# Altium project APD.PrjPcb
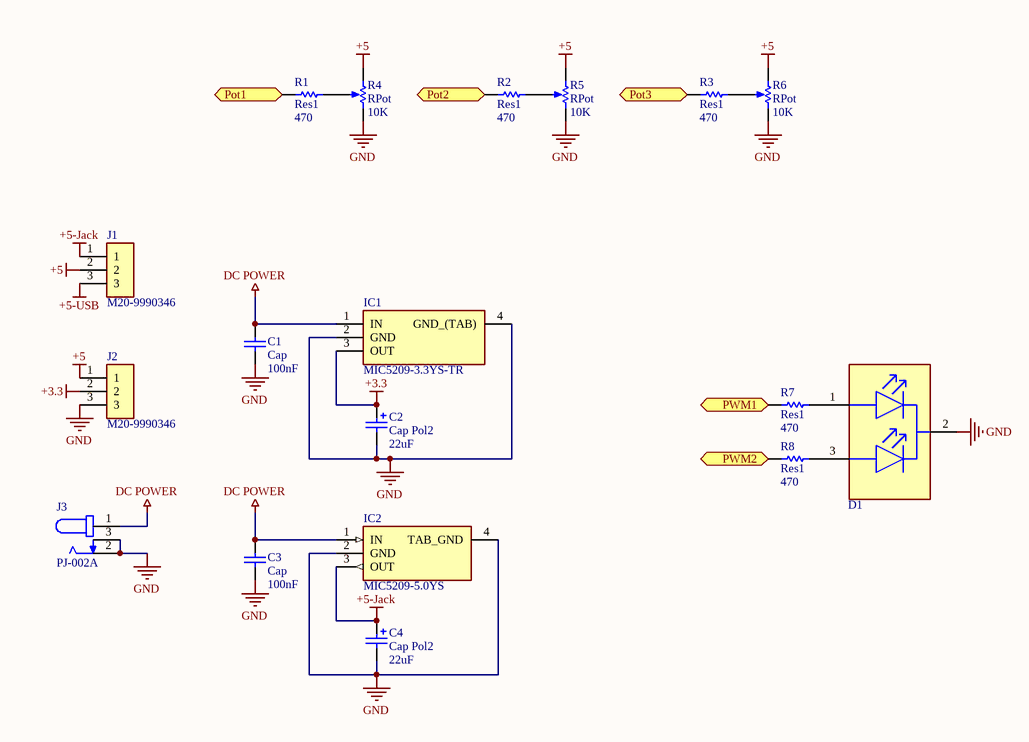
[diagram p0: Power.SchDoc]
5 sheets, 67 parts. Net scope: flat (ports and power ports of the same name join across sheets).
Board file: PCB1.PcbDoc
Sheets:
  Power.SchDoc
  PIC.SchDoc
  LCD-MEM-TEMP.SchDoc
  UART.SchDoc
  Switch.SchDoc

## Sheet Power.SchDoc
size A4

### Parts
C1  Cap  value 100nF  [Cap 100nF]
C2  Cap Pol2  value 22uF  [CAP+ 22UF]
C3  Cap  value 100nF  [Cap 100nF]
C4  Cap Pol2  value 22uF  [CAP+ 22UF]
D1  LTL1BEKVJNN  [Bicolor LED]  (value not drawn)
IC1  MIC5209-3.3YS-TR  [LDO]
IC2  MIC5209-5.0YS  [LDO]
J1  M20-9990346  [header 3 pins male]
J2  M20-9990346  [Header 3 pins fem.]
J3  PJ-002A  [DC Jack]
R1  Res1  value 470  [Resistor 1210]
R2  Res1  value 470  [Resistor 1210]
R3  Res1  value 470  [Resistor 1210]
R4  RPot  value 10K  [POT]
R5  RPot  value 10K  [POT]
R6  RPot  value 10K  [POT]
R7  Res1  value 470  [Resistor 1210]
R8  Res1  value 470  [Resistor 1210]

### Ports
Pot1 (bidir), Pot2 (bidir), Pot3 (bidir), PWM1 (bidir), PWM2 (bidir)

### Nets
+3.3: C2.1 IC1.3(OUT) J2.2
+5: J1.2 J2.1 R4.1(TOP) R5.1(TOP) R6.1(TOP)
+5-Jack: C4.1 IC2.3(OUT) J1.1
+5-USB: J1.3
DC POWER: C1.1 C3.1 IC1.1(IN) IC2.1(IN) J3.1
GND: C1.2 C2.2 C3.2 C4.2 D1.2(COMMON_CATHODE) IC1.2(GND) IC1.4(GND_(TAB)) IC2.2(GND) IC2.4(TAB_GND) J2.3 J3.2 J3.3 R4.2(BOT) R5.2(BOT) R6.2(BOT)
NetD1_1: D1.1(RED_A) R7.2
NetD1_3: D1.3(GREEN_A) R8.2
NetIC3_2: R1.1 ; port Pot1
NetIC3_3: R2.1 ; port Pot2
NetIC3_4: R3.1 ; port Pot3
NetIC3_12: R8.1 ; port PWM2
NetIC3_13: R7.1 ; port PWM1
NetR1_2: R1.2 R4.3(TAP)
NetR2_2: R2.2 R5.3(TAP)
NetR3_2: R3.2 R6.3(TAP)

### Library data of the parts
C1 C3 = Cap: Capacitor; Published: 8-Jun-2000; LatestRevisionDate: 17-Jul-2002; LatestRevisionNote: Re-released for DXP Platform.; PackageReference: RAD-0.3; Publisher: Altium Limited; PackageDescription: Radial Cap, Thru-Hole; 2 Leads; 0.3 in Pin Spacing
C2 C4 = Cap Pol2: Polarized Capacitor (Axial); Published: 8-Jun-2000; LatestRevisionDate: 17-Jul-2002; LatestRevisionNote: Re-released for DXP Platform.; PackageReference: POLAR0.8; Publisher: Altium Limited; PackageDescription: Polarized Capacitor; 2 Leads
IC1 = MIC5209-3.3YS-TR: Integrated Circuit; Manufacturer_Name: Microchip; Datasheet Link: http://ww1.microchip.com/downloads/en/DeviceDoc/mic5209.pdf; Height: 1.7mm; Manufacturer_Part_Number: MIC5209-3.3YS-TR; Arrow Part Number: MIC5209-3.3YS-TR; Arrow Price/Stock: https://www.arrow.com/en/products/mic5209-3.3ys-tr/microchip-technology; Mouser Part Number: 998-MIC5209-3.3YSTR; Mouser Price/Stock: https://www.mouser.co.uk/ProductDetail/Microchip-Technology-Micrel/MIC5209-33YS-TR?qs=U6T8BxXiZAXms9mvoyYO%2FQ%3D%3D
IC2 = MIC5209-5.0YS: Integrated Circuit; Manufacturer_Name: Microchip; Datasheet Link: http://www.micrel.com/_PDF/mic5209.pdf; Height: 1.8mm; Manufacturer_Part_Number: MIC5209-5.0YS; Arrow Part Number: MIC5209-5.0YS; Arrow Price/Stock: https://www.arrow.com/en/products/mic5209-5.0ys/microchip-technology; Mouser Part Number: 998-MIC5209-5.0YS; Mouser Price/Stock: https://www.mouser.com/Search/Refine.aspx?Keyword=998-MIC5209-5.0YS
J1 J2 = M20-9990346: Connector; Manufacturer_Name: Harwin; Datasheet Link: http://uk.rs-online.com/web/p/products/7457068; Height: 8.64mm; Manufacturer_Part_Number: M20-9990346; Mouser Part Number: 855-M20-9990346; Mouser Price/Stock: https://www.mouser.co.uk/ProductDetail/Harwin/M20-9990346?qs=ulE8k0yEMYbyhQ3uXpFs8Q%3D%3D
J3 = PJ-002A: DC jack; MF: CUI Devices; Package: None; Price: None; CUI_purchase_URL: https://www.cuidevices.com/product/interconnect/connectors/dc-power-connectors/jacks/pj-002a?utm_source=snapeda.com&utm_medium=referral&utm_campaign=snapedaBOM; SnapEDA_Link: https://www.snapeda.com/parts/PJ-002A/CUI%20Devices/view-part/287588/?ref=snap; Availability: Unavailable; Value: *; MP: PJ-002A
R1-R3 R7 R8 = Res1: Resistor; Published: 8-Jun-2000; LatestRevisionDate: 17-Jul-2002; LatestRevisionNote: Re-released for DXP Platform.; PackageReference: AXIAL-0.3; Publisher: Altium Limited; PackageDescription: Axial Device, Thru-Hole; 2 Leads; 0.3 in Pin Spacing
R4-R6 = RPot: Potentiometer; Sim Note: Enter the Resistance value and the set point into parameter fields.; Set Position: 0.5; Published: 8-Jun-2000; LatestRevisionDate: 17-Jul-2002; LatestRevisionNote: Re-released for DXP Platform.; PackageReference: VR5; Publisher: Altium Limited; PackageDescription: Variable Resistor, Thru-Hole; 3 Leads

## Sheet PIC.SchDoc
size A4
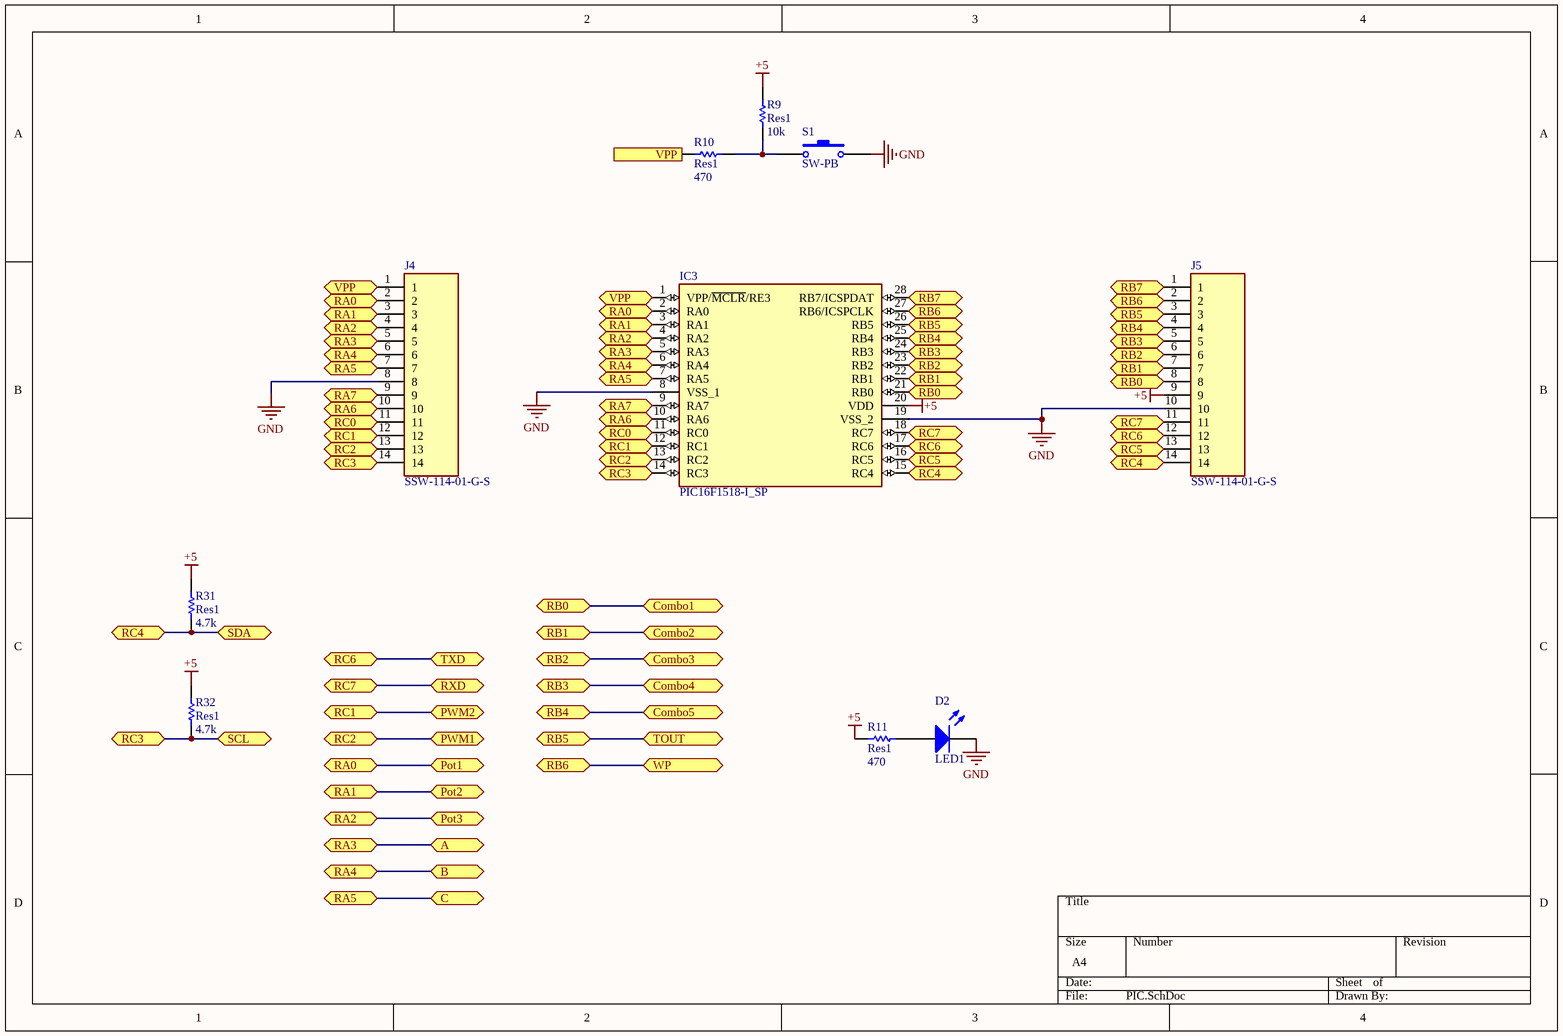
[diagram p1: PIC.SchDoc]

### Parts
D2  LED1  [LED 3mm]
IC3  PIC16F1518-I_SP  [DIP28]
J4  SSW-114-01-G-S  [Header 14 pins fem.]
J5  SSW-114-01-G-S  [Header 14 pins fem.]
R9  Res1  value 10k  [Resistor 1210]
R10  Res1  value 470  [Resistor 1210]
R11  Res1  value 470  [Resistor 1210]
R31  Res1  value 4.7k  [Resistor 1206]
R32  Res1  value 4.7k  [Resistor 1206]
S1  SW-PB  [Button]

### Ports
A (bidir), B (bidir), C (bidir), Combo1 (bidir), Combo2 (bidir), Combo3 (bidir), Combo4 (bidir), Combo5 (bidir), Pot1 (bidir), Pot2 (bidir), Pot3 (bidir), PWM1 (bidir), PWM2 (bidir), RA0 (bidir), RA1 (bidir), RA2 (bidir), RA3 (bidir), RA4 (bidir), RA5 (bidir), RA6 (bidir), RA7 (bidir), RB0 (bidir), RB1 (bidir), RB2 (bidir), RB3 (bidir), RB4 (bidir), RB5 (bidir), RB6 (bidir), RB7 (bidir), RC0 (bidir), RC1 (bidir), RC2 (bidir), RC3 (bidir), RC4 (bidir), RC5 (bidir), RC6 (bidir), RC7 (bidir), RXD (bidir), SCL (bidir), SDA (bidir), TOUT (bidir), TXD (bidir), VPP (bidir), VPP (out), WP (bidir)

### Nets
+5: IC3.20(VDD) J5.9 R9.2 R11.1 R31.2 R32.2
GND: D2.2(K) IC3.8(VSS_1) IC3.19(VSS_2) J4.8 J5.10 S1.2
NetD2_1: D2.1(A) R11.2
NetIC3_1: IC3.1(VPP/~{MCLR}/RE3) J4.1 R10.1 ; port VPP
NetIC3_2: IC3.2(RA0) J4.2 ; port RA0, port Pot1
NetIC3_3: IC3.3(RA1) J4.3 ; port RA1, port Pot2
NetIC3_4: IC3.4(RA2) J4.4 ; port RA2, port Pot3
NetIC3_5: IC3.5(RA3) J4.5 ; port RA3, port A
NetIC3_6: IC3.6(RA4) J4.6 ; port RA4, port B
NetIC3_7: IC3.7(RA5) J4.7 ; port RA5, port C
NetIC3_9: IC3.9(RA7) J4.9 ; port RA7
NetIC3_10: IC3.10(RA6) J4.10 ; port RA6
NetIC3_11: IC3.11(RC0) J4.11 ; port RC0
NetIC3_12: IC3.12(RC1) J4.12 ; port RC1, port PWM2
NetIC3_13: IC3.13(RC2) J4.13 ; port RC2, port PWM1
NetIC3_14: IC3.14(RC3) J4.14 R32.1 ; port RC3, port SCL
NetIC3_15: IC3.15(RC4) J5.14 R31.1 ; port RC4, port SDA
NetIC3_16: IC3.16(RC5) J5.13 ; port RC5
NetIC3_17: IC3.17(RC6) J5.12 ; port RC6, port TXD
NetIC3_18: IC3.18(RC7) J5.11 ; port RC7, port RXD
NetIC3_21: IC3.21(RB0) J5.8 ; port RB0, port Combo1
NetIC3_22: IC3.22(RB1) J5.7 ; port RB1, port Combo2
NetIC3_23: IC3.23(RB2) J5.6 ; port RB2, port Combo3
NetIC3_24: IC3.24(RB3) J5.5 ; port RB3, port Combo4
NetIC3_25: IC3.25(RB4) J5.4 ; port RB4, port Combo5
NetIC3_26: IC3.26(RB5) J5.3 ; port RB5, port TOUT
NetIC3_27: IC3.27(RB6/ICSPCLK) J5.2 ; port RB6, port WP
NetIC3_28: IC3.28(RB7/ICSPDAT) J5.1 ; port RB7
NetR9_1: R9.1 R10.2 S1.1

### Library data of the parts
D2 = LED1: Typical RED GaAs LED; Published: 8-Jun-2000; LatestRevisionDate: 08-Jul-2005; LatestRevisionNote: Mech Layer 1 removed.; PackageReference: LED-1; Publisher: Altium Limited; PackageDescription: LED; 2 Leads
IC3 = PIC16F1518-I_SP: Integrated Circuit; Manufacturer_Name: Microchip; Manufacturer_Part_Number: PIC16F1518-I/SP; Datasheet Link: http://ww1.microchip.com/downloads/en/DeviceDoc/40001452F.pdf; Height: 5.08mm; Arrow Part Number: PIC16F1518-I/SP; Arrow Price/Stock: https://www.arrow.com/en/products/pic16f1518-isp/microchip-technology; Mouser Part Number: 579-PIC16F1518-I/SP; Mouser Price/Stock: https://www.mouser.com/Search/Refine.aspx?Keyword=579-PIC16F1518-I%2FSP
J4 J5 = SSW-114-01-G-S: Connector; Manufacturer_Name: SAMTEC; Datasheet Link: https://eu.mouser.com/datasheet/2/527/ssw_th-1507658.pdf; Height: 8.51mm; Manufacturer_Part_Number: SSW-114-01-G-S; Arrow Part Number: SSW-114-01-G-S; Arrow Price/Stock: https://www.arrow.com/en/products/ssw-114-01-g-s/samtec; Mouser Part Number: 200-SSW11401GS; Mouser Price/Stock: https://www.mouser.co.uk/ProductDetail/Samtec/SSW-114-01-G-S?qs=FESYatJ8odJdl4aGY%2FwgtQ%3D%3D
R9-R11 R31 R32 = Res1: Resistor; Published: 8-Jun-2000; LatestRevisionDate: 17-Jul-2002; LatestRevisionNote: Re-released for DXP Platform.; PackageReference: AXIAL-0.3; Publisher: Altium Limited; PackageDescription: Axial Device, Thru-Hole; 2 Leads; 0.3 in Pin Spacing
S1 = SW-PB: Switch; Published: 24-Mar-1999; LatestRevisionDate: 17-Jul-2002; LatestRevisionNote: Re-released for DXP Platform.; PackageReference: SPST-2; Publisher: Altium Limited; PackageDescription: Switch; 2 Leads

## Sheet LCD-MEM-TEMP.SchDoc
size A4
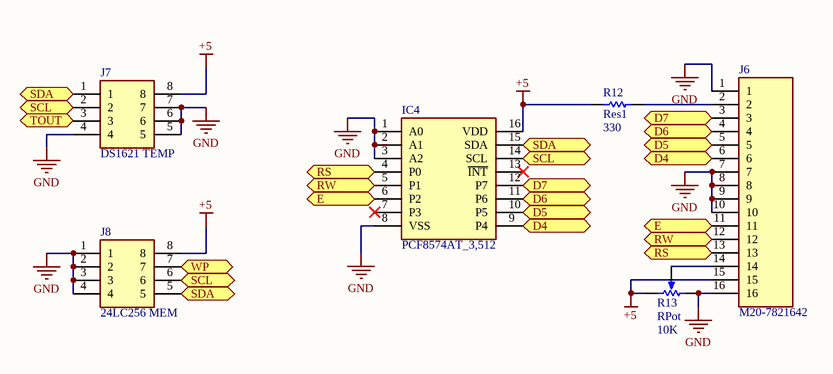
[diagram p2: LCD-MEM-TEMP.SchDoc]

### Parts
IC4  PCF8574AT_3,512  [I2C LCD IC]
J6  M20-7821642  [Header 16 pins fem.]
J7  DS1621 TEMP  [DIL 8 pins]
J8  24LC256 MEM  [DIL 8 pins]
R12  Res1  value 330  [Resistor 1210]
R13  RPot  value 10K  [POT]

### Ports
D4 (bidir), D5 (bidir), D6 (bidir), D7 (bidir), E (bidir), RS (bidir), RW (bidir), SCL (bidir), SDA (bidir), TOUT (bidir), WP (bidir)

### Nets
+5: IC4.16(VDD) J6.15 J7.8 J8.8 R12.1 R13.2(BOT)
GND: IC4.1(A0) IC4.2(A1) IC4.3(A2) IC4.8(VSS) J6.1 J6.7 J6.8 J6.9 J6.10 J6.16 J7.4 J7.5 J7.6 J7.7 J8.1 J8.2 J8.3 J8.4 R13.1(TOP)
NetIC3_14: IC4.14(SCL) J7.2 J8.6 ; port SCL
NetIC3_15: IC4.15(SDA) J7.1 J8.5 ; port SDA
NetIC3_27: J8.7 ; port WP
NetIC4_4: IC4.4(P0) J6.13 ; port RS
NetIC4_5: IC4.5(P1) J6.12 ; port RW
NetIC4_6: IC4.6(P2) J6.11 ; port E
NetIC4_9: IC4.9(P4) J6.6 ; port D4
NetIC4_10: IC4.10(P5) J6.5 ; port D5
NetIC4_11: IC4.11(P6) J6.4 ; port D6
NetIC4_12: IC4.12(P7) J6.3 ; port D7
NetJ6_2: J6.2 R12.2
NetJ6_14: J6.14 R13.3(TAP)

Not connected (* = marked no-connect by the designer): IC4 7(P3)* 13(~{INT})*; J7 3

### Library data of the parts
IC4 = PCF8574AT_3,512: Integrated Circuit; Manufacturer_Name: Nexperia; Manufacturer_Part_Number: PCF8574AT/3,512; Datasheet Link: https://www.nxp.com/docs/en/data-sheet/PCF8574_PCF8574A.pdf; Height: 2.65mm; Arrow Part Number: PCF8574AT/3,512; Arrow Price/Stock: https://www.arrow.com/en/products/pcf8574at3512/nxp-semiconductors; Mouser Part Number: 771-PCF85AT3512; Mouser Price/Stock: https://www.mouser.com/Search/Refine.aspx?Keyword=771-PCF85AT3512
J6 = M20-7821642: Connector; Manufacturer_Name: Harwin; Datasheet Link: https://componentsearchengine.com//M20-7821642.pdf; Height: 8.65mm; Mouser2 Part Number: 855-M20-7821642; Mouser2 Price/Stock: https://www.mouser.com/Search/Refine.aspx?Keyword=855-M20-7821642; Manufacturer_Part_Number: M20-7821642
J7 J8 = 110-41-308-41-001000: Connector; Manufacturer_Name: Mill-Max; Datasheet Link: https://www.arrow.com/en/products/110-41-308-41-001000/mill-max; Height: 4.19mm; Manufacturer_Part_Number: 110-41-308-41-001000
R12 = Res1: Resistor; Published: 8-Jun-2000; LatestRevisionDate: 17-Jul-2002; LatestRevisionNote: Re-released for DXP Platform.; PackageReference: AXIAL-0.3; Publisher: Altium Limited; PackageDescription: Axial Device, Thru-Hole; 2 Leads; 0.3 in Pin Spacing
R13 = RPot: as R4 on sheet Power; Published: 8-Jun-2000; LatestRevisionDate: 17-Jul-2002; LatestRevisionNote: Re-released for DXP Platform.; PackageReference: VR5; Publisher: Altium Limited; PackageDescription: Variable Resistor, Thru-Hole; 3 Leads

## Sheet UART.SchDoc
size A4
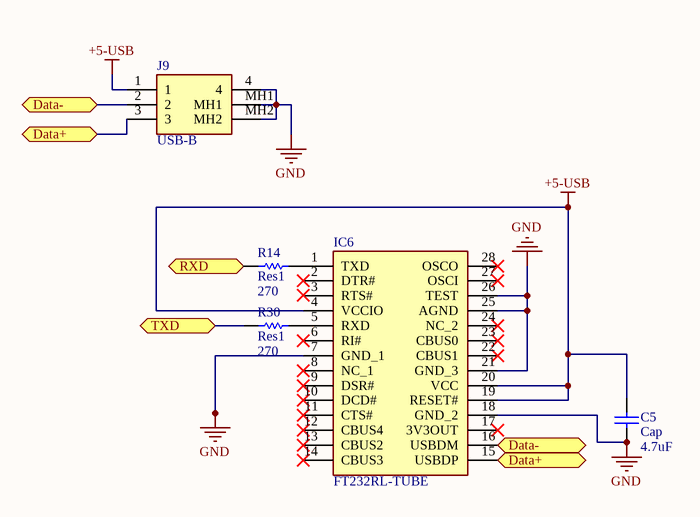
[diagram p3: UART.SchDoc]

### Parts
C5  Cap  value 4.7uF  [cap 4.7uf]
IC6  FT232RL-TUBE  [SOP65P780X200-28N]
J9  USB-B  [USB B]
R14  Res1  value 270  [Resistor 1206]
R30  Res1  value 270  [Resistor 1206]

### Ports
Data+ (bidir), Data- (bidir), RXD (bidir), TXD (bidir)

### Nets
+5-USB: C5.2 IC6.4(VCCIO) IC6.19(RESET#) IC6.20(VCC) J9.1
GND: C5.1 IC6.7(GND_1) IC6.18(GND_2) IC6.21(GND_3) IC6.25(AGND) IC6.26(TEST) J9.4 J9.MH1 J9.MH2
NetIC3_17: R30.1 ; port TXD
NetIC3_18: R14.1 ; port RXD
NetIC6_1: IC6.1(TXD) R14.2
NetIC6_5: IC6.5(RXD) R30.2
NetIC6_15: IC6.15(USBDP) J9.3 ; port Data+
NetIC6_16: IC6.16(USBDM) J9.2 ; port Data-

Not connected (* = marked no-connect by the designer): IC6 2(DTR#)* 3(RTS#)* 6(RI#)* 8(NC_1)* 9(DSR#)* 10(DCD#)* 11(CTS#)* 12(CBUS4)* 13(CBUS2)* 14(CBUS3)* 17(3V3OUT)* 22(CBUS1)* 23(CBUS0)* 24(NC_2)* 27(OSCI)* 28(OSCO)*

### Library data of the parts
C5 = Cap: Capacitor; Published: 8-Jun-2000; LatestRevisionDate: 17-Jul-2002; LatestRevisionNote: Re-released for DXP Platform.; PackageReference: RAD-0.3; Publisher: Altium Limited; PackageDescription: Radial Cap, Thru-Hole; 2 Leads; 0.3 in Pin Spacing
IC6 = FT232RL-TUBE: Integrated Circuit; Manufacturer_Name: FTDI Chip; Datasheet Link: http://www.ftdichip.com/Support/Documents/DataSheets/ICs/DS_FT232R.pdf; Height: 2mm; Manufacturer_Part_Number: FT232RL-TUBE; Arrow Part Number: FT232RL-TUBE; Arrow Price/Stock: https://www.arrow.com/en/products/ft232rl-tube/ftdi-chip; Mouser Part Number: 895-FT232RL-TUBE; Mouser Price/Stock: https://www.mouser.co.uk/ProductDetail/FTDI/FT232RL-TUBE?qs=D1%2FPMqvA100UF95YMvGN8w%3D%3D
J9 = USBR-B-S-S-O-TH: Connector; Manufacturer_Name: SAMTEC; Datasheet Link: https://componentsearchengine.com/Datasheets/2/USBR-B-S-S-O-TH.pdf; Height: 11mm; Manufacturer_Part_Number: USBR-B-S-S-O-TH; Arrow Part Number: USBR-B-S-S-O-TH; Arrow Price/Stock: https://www.arrow.com/en/products/usbr-b-s-s-o-th/samtec; Mouser Part Number: 200-USBRBSSOTH; Mouser Price/Stock: https://www.mouser.co.uk/ProductDetail/Samtec/USBR-B-S-S-O-TH?qs=Sk19l0%2FxcWm4mdmoDSlrBQ%3D%3D
R14 R30 = Res1: Resistor; Published: 8-Jun-2000; LatestRevisionDate: 17-Jul-2002; LatestRevisionNote: Re-released for DXP Platform.; PackageReference: AXIAL-0.3; Publisher: Altium Limited; PackageDescription: Axial Device, Thru-Hole; 2 Leads; 0.3 in Pin Spacing

## Sheet Switch.SchDoc
size A4
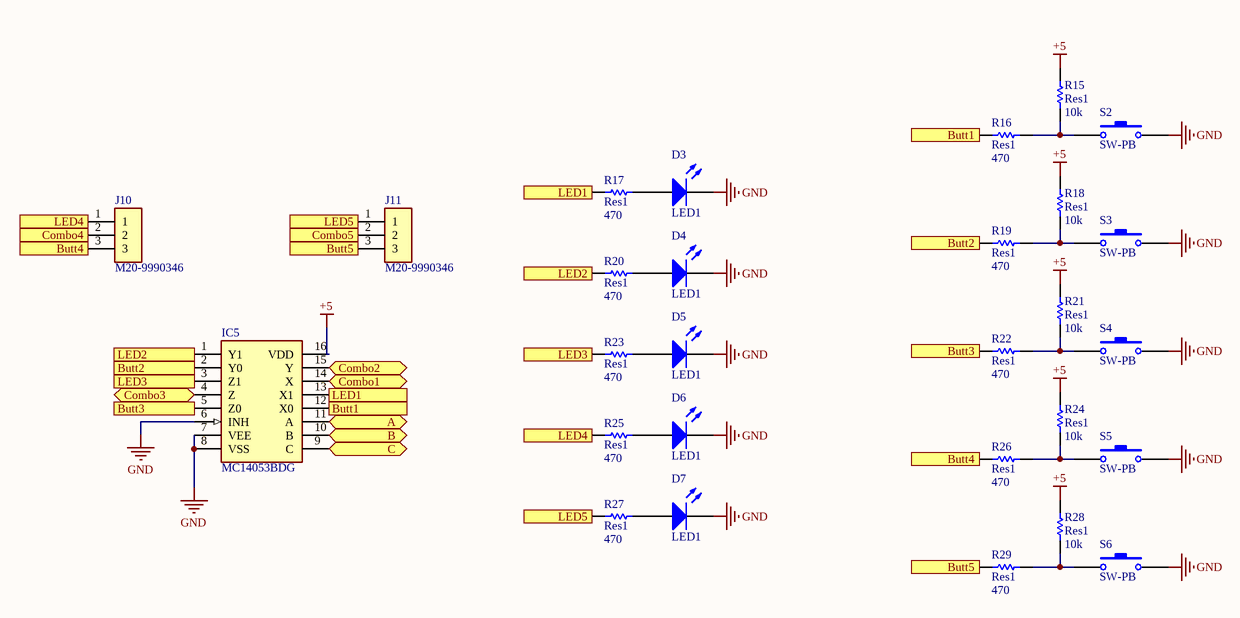
[diagram p4: Switch.SchDoc]

### Parts
D3  LED1  [LED 3mm]
D4  LED1  [LED 3mm]
D5  LED1  [LED 3mm]
D6  LED1  [LED 3mm]
D7  LED1  [LED 3mm]
IC5  MC14053BDG  [Triple SPDT switch]
J10  M20-9990346  [header 3 pins male]
J11  M20-9990346  [header 3 pins male]
R15  Res1  value 10k  [Resistor 1210]
R16  Res1  value 470  [Resistor 1210]
R17  Res1  value 470  [Resistor 1210]
R18  Res1  value 10k  [Resistor 1210]
R19  Res1  value 470  [Resistor 1210]
R20  Res1  value 470  [Resistor 1210]
R21  Res1  value 10k  [Resistor 1210]
R22  Res1  value 470  [Resistor 1210]
R23  Res1  value 470  [Resistor 1210]
R24  Res1  value 10k  [Resistor 1210]
R25  Res1  value 470  [Resistor 1210]
R26  Res1  value 470  [Resistor 1210]
R27  Res1  value 470  [Resistor 1210]
R28  Res1  value 10k  [Resistor 1210]
R29  Res1  value 470  [Resistor 1210]
S2  SW-PB  [Button]
S3  SW-PB  [Button]
S4  SW-PB  [Button]
S5  SW-PB  [Button]
S6  SW-PB  [Button]

### Ports
A (bidir), B (bidir), Butt1 (in), Butt1 (out), Butt2 (in), Butt2 (out), Butt3 (in), Butt3 (out), Butt4 (in), Butt4 (out), Butt5 (in), Butt5 (out), C (bidir), Combo1 (bidir), Combo2 (bidir), Combo3 (bidir), Combo4, Combo5, LED1 (in), LED1 (out), LED2 (in), LED2 (out), LED3 (in), LED3 (out), LED4 (in), LED4 (out), LED5 (in), LED5 (out)

### Nets
+5: IC5.16(VDD) R15.2 R18.2 R21.2 R24.2 R28.2
GND: D3.2(K) D4.2(K) D5.2(K) D6.2(K) D7.2(K) IC5.6(INH) IC5.7(VEE) IC5.8(VSS) S2.2 S3.2 S4.2 S5.2 S6.2
NetD3_1: D3.1(A) R17.1
NetD4_1: D4.1(A) R20.1
NetD5_1: D5.1(A) R23.1
NetD6_1: D6.1(A) R25.1
NetD7_1: D7.1(A) R27.1
NetIC3_5: IC5.11(A) ; port A
NetIC3_6: IC5.10(B) ; port B
NetIC3_7: IC5.9(C) ; port C
NetIC3_21: IC5.14(X) ; port Combo1
NetIC3_22: IC5.15(Y) ; port Combo2
NetIC3_23: IC5.4(Z) ; port Combo3
NetIC3_24: J10.2 ; port Combo4
NetIC3_25: J11.2 ; port Combo5
NetIC5_1: IC5.1(Y1) R20.2 ; port LED2
NetIC5_2: IC5.2(Y0) R19.1 ; port Butt2
NetIC5_3: IC5.3(Z1) R23.2 ; port LED3
NetIC5_5: IC5.5(Z0) R22.1 ; port Butt3
NetIC5_12: IC5.12(X0) R16.1 ; port Butt1
NetIC5_13: IC5.13(X1) R17.2 ; port LED1
NetJ10_1: J10.1 R25.2 ; port LED4
NetJ10_3: J10.3 R26.1 ; port Butt4
NetJ11_1: J11.1 R27.2 ; port LED5
NetJ11_3: J11.3 R29.1 ; port Butt5
NetR15_1: R15.1 R16.2 S2.1
NetR18_1: R18.1 R19.2 S3.1
NetR21_1: R21.1 R22.2 S4.1
NetR24_1: R24.1 R26.2 S5.1
NetR28_1: R28.1 R29.2 S6.1

### Library data of the parts
D3-D7 = LED1: Typical RED GaAs LED; Published: 8-Jun-2000; LatestRevisionDate: 08-Jul-2005; LatestRevisionNote: Mech Layer 1 removed.; PackageReference: LED-1; Publisher: Altium Limited; PackageDescription: LED; 2 Leads
IC5 = MC14053BDG: Integrated Circuit; Manufacturer_Name: ON Semiconductor; Datasheet Link: http://www.onsemi.com/pub/Collateral/MC14051B-D.PDF; Height: 1.75mm; Manufacturer_Part_Number: MC14053BDG; Arrow Part Number: MC14053BDG; Arrow Price/Stock: https://www.arrow.com/en/products/mc14053bdg/on-semiconductor; Mouser Part Number: 863-MC14053BDG; Mouser Price/Stock: https://www.mouser.co.uk/ProductDetail/ON-Semiconductor/MC14053BDG?qs=g2rIOKKlpobK7Wa1TqI4Yg%3D%3D
J10 J11 = M20-9990346: Connector; Manufacturer_Name: Harwin; Datasheet Link: http://uk.rs-online.com/web/p/products/7457068; Height: 8.64mm; Manufacturer_Part_Number: M20-9990346; Mouser Part Number: 855-M20-9990346; Mouser Price/Stock: https://www.mouser.co.uk/ProductDetail/Harwin/M20-9990346?qs=ulE8k0yEMYbyhQ3uXpFs8Q%3D%3D
R15-R29 = Res1: Resistor; Published: 8-Jun-2000; LatestRevisionDate: 17-Jul-2002; LatestRevisionNote: Re-released for DXP Platform.; PackageReference: AXIAL-0.3; Publisher: Altium Limited; PackageDescription: Axial Device, Thru-Hole; 2 Leads; 0.3 in Pin Spacing
S2-S6 = SW-PB: Switch; Published: 24-Mar-1999; LatestRevisionDate: 17-Jul-2002; LatestRevisionNote: Re-released for DXP Platform.; PackageReference: SPST-2; Publisher: Altium Limited; PackageDescription: Switch; 2 Leads

## Nets that join several sheets
+5: Power (5 pins), PIC (6 pins), LCD-MEM-TEMP (6 pins), Switch (6 pins)
+5-USB: Power (J1.3), UART (5 pins)
GND: Power (15 pins), PIC (6 pins), LCD-MEM-TEMP (19 pins), UART (9 pins), Switch (13 pins)
NetIC3_2: Power (R1.1), PIC (IC3.2 J4.2)
NetIC3_3: Power (R2.1), PIC (IC3.3 J4.3)
NetIC3_4: Power (R3.1), PIC (IC3.4 J4.4)
NetIC3_5: PIC (IC3.5 J4.5), Switch (IC5.11)
NetIC3_6: PIC (IC3.6 J4.6), Switch (IC5.10)
NetIC3_7: PIC (IC3.7 J4.7), Switch (IC5.9)
NetIC3_12: Power (R8.1), PIC (IC3.12 J4.12)
NetIC3_13: Power (R7.1), PIC (IC3.13 J4.13)
NetIC3_14: PIC (IC3.14 J4.14 R32.1), LCD-MEM-TEMP (IC4.14 J7.2 J8.6)
NetIC3_15: PIC (IC3.15 J5.14 R31.1), LCD-MEM-TEMP (IC4.15 J7.1 J8.5)
NetIC3_17: PIC (IC3.17 J5.12), UART (R30.1)
NetIC3_18: PIC (IC3.18 J5.11), UART (R14.1)
NetIC3_21: PIC (IC3.21 J5.8), Switch (IC5.14)
NetIC3_22: PIC (IC3.22 J5.7), Switch (IC5.15)
NetIC3_23: PIC (IC3.23 J5.6), Switch (IC5.4)
NetIC3_24: PIC (IC3.24 J5.5), Switch (J10.2)
NetIC3_25: PIC (IC3.25 J5.4), Switch (J11.2)
NetIC3_27: PIC (IC3.27 J5.2), LCD-MEM-TEMP (J8.7)